# Altium schematic sheet Dumping_servo.SchDoc
size A
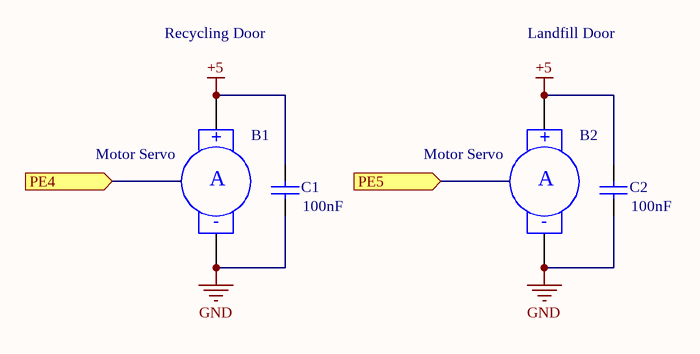
[diagram p0: Dumping_servo.SchDoc]

## Parts
B1  Motor Servo  [RAD-0.4]
B2  Motor Servo  [RAD-0.4]
C1  value 100nF  [RAD-0.3]  (hidden comment: Cap)
C2  value 100nF  [RAD-0.3]  (hidden comment: Cap)

## Ports
PE4 (in), PE5 (in)

## Nets
+5: B1.1(+) B2.1(+) C1.2 C2.2
GND: B1.2(-) B2.2(-) C1.1 C2.1

## Notes on the sheet
- Recycling Door
- Landfill Door
- (in symbol Motor Servo) A

## Library data of the parts
B1 B2 = Motor Servo: Servo Motor; Published: 24-Mar-1999; LatestRevisionDate: 17-Jul-2002; LatestRevisionNote: Re-released for DXP Platform.; PackageReference: RAD-0.4; Publisher: Altium Limited; PackageDescription: Radial Cap, Thru-Hole; 2 Leads; 0.4 in Pin Spacing
C1 C2 = Cap: Capacitor; Published: 8-Jun-2000; LatestRevisionDate: 17-Jul-2002; LatestRevisionNote: Re-released for DXP Platform.; PackageReference: RAD-0.3; Publisher: Altium Limited; PackageDescription: Radial Cap, Thru-Hole; 2 Leads; 0.3 in Pin Spacing